# Altium schematic sheet FET_M2.SchDoc
size A
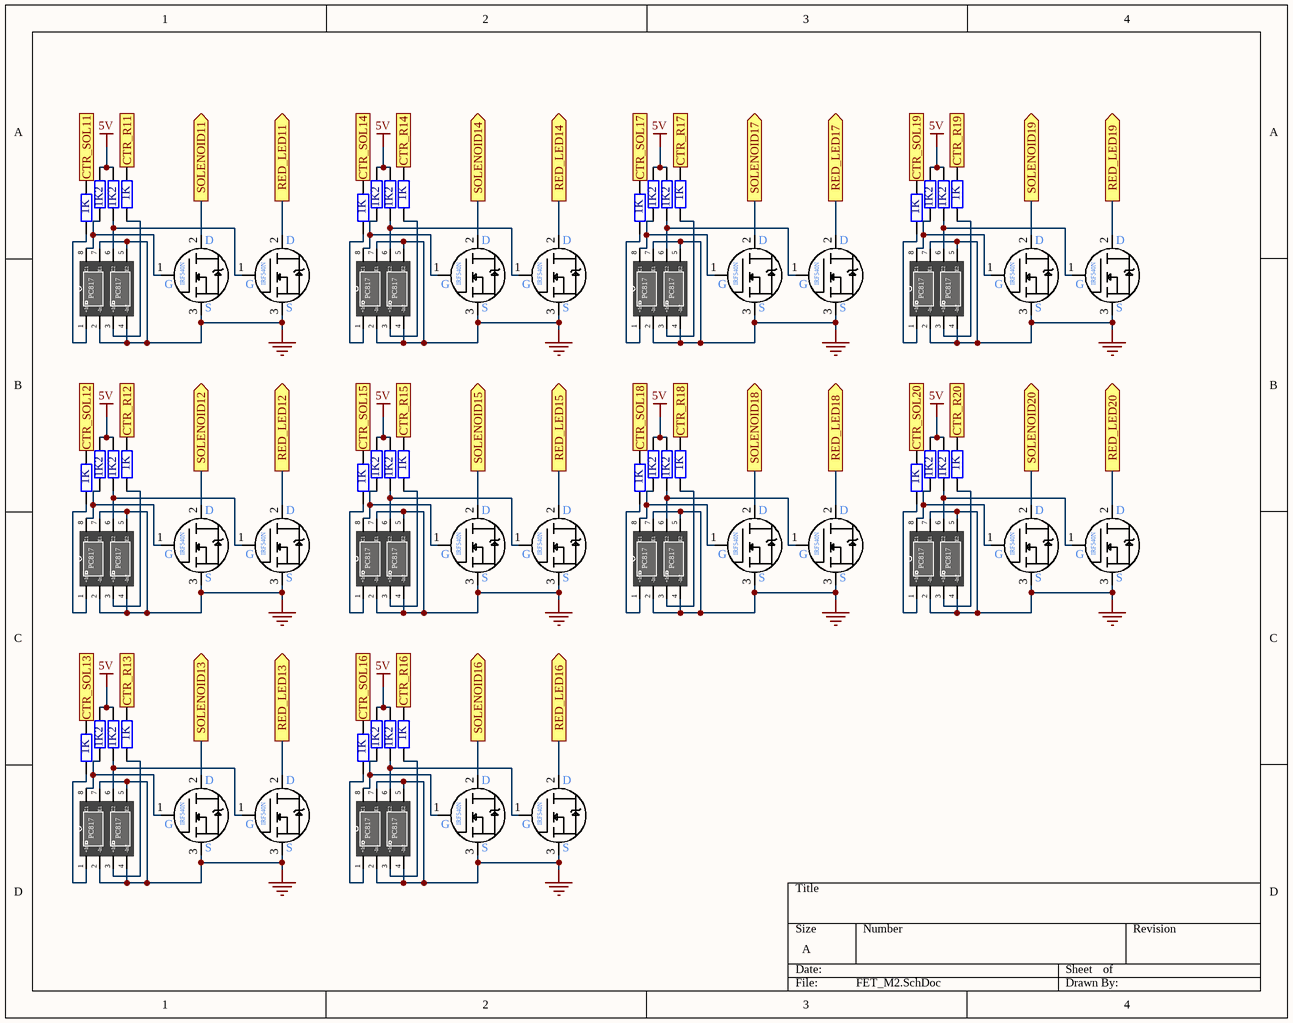
[diagram p0: FET_M2.SchDoc]

## Parts
FET21  5#IRF540N  [5#IRF540N]  (value not drawn)
FET22  5#IRF540N  [5#IRF540N]  (value not drawn)
FET23  5#IRF540N  [5#IRF540N]  (value not drawn)
FET24  5#IRF540N  [5#IRF540N]  (value not drawn)
FET25  5#IRF540N  [5#IRF540N]  (value not drawn)
FET26  5#IRF540N  [5#IRF540N]  (value not drawn)
FET27  5#IRF540N  [5#IRF540N]  (value not drawn)
FET28  5#IRF540N  [5#IRF540N]  (value not drawn)
FET29  5#IRF540N  [5#IRF540N]  (value not drawn)
FET30  5#IRF540N  [5#IRF540N]  (value not drawn)
FET31  5#IRF540N  [5#IRF540N]  (value not drawn)
FET32  5#IRF540N  [5#IRF540N]  (value not drawn)
FET33  5#IRF540N  [5#IRF540N]  (value not drawn)
FET34  5#IRF540N  [5#IRF540N]  (value not drawn)
FET35  5#IRF540N  [5#IRF540N]  (value not drawn)
FET36  5#IRF540N  [5#IRF540N]  (value not drawn)
FET37  5#IRF540N  [5#IRF540N]  (value not drawn)
FET38  5#IRF540N  [5#IRF540N]  (value not drawn)
FET39  5#IRF540N  [5#IRF540N]  (value not drawn)
FET40  5#IRF540N  [5#IRF540N]  (value not drawn)
PC11  5#Dip8_PC817x2  [5#Dip8_PC817x2]  (value not drawn)
PC12  5#Dip8_PC817x2  [5#Dip8_PC817x2]  (value not drawn)
PC13  5#Dip8_PC817x2  [5#Dip8_PC817x2]  (value not drawn)
PC14  5#Dip8_PC817x2  [5#Dip8_PC817x2]  (value not drawn)
PC15  5#Dip8_PC817x2  [5#Dip8_PC817x2]  (value not drawn)
PC16  5#Dip8_PC817x2  [5#Dip8_PC817x2]  (value not drawn)
PC17  5#Dip8_PC817x2  [5#Dip8_PC817x2]  (value not drawn)
PC18  5#Dip8_PC817x2  [5#Dip8_PC817x2]  (value not drawn)
PC19  5#Dip8_PC817x2  [5#Dip8_PC817x2]  (value not drawn)
PC20  5#Dip8_PC817x2  [5#Dip8_PC817x2]  (value not drawn)
R66  1K2  [AXIAL-0.4]
R67  1K2  [AXIAL-0.4]
R68  1K  [AXIAL-0.4]
R69  1K2  [AXIAL-0.4]
R70  1K2  [AXIAL-0.4]
R71  1K  [AXIAL-0.4]
R72  1K2  [AXIAL-0.4]
R73  1K2  [AXIAL-0.4]
R74  1K  [AXIAL-0.4]
R75  1K2  [AXIAL-0.4]
R76  1K2  [AXIAL-0.4]
R77  1K  [AXIAL-0.4]
R78  1K  [AXIAL-0.4]
R79  1K  [AXIAL-0.4]
R80  1K  [AXIAL-0.4]
R81  1K  [AXIAL-0.4]
R82  1K2  [AXIAL-0.4]
R83  1K2  [AXIAL-0.4]
R84  1K  [AXIAL-0.4]
R85  1K2  [AXIAL-0.4]
R86  1K2  [AXIAL-0.4]
R87  1K  [AXIAL-0.4]
R88  1K2  [AXIAL-0.4]
R89  1K2  [AXIAL-0.4]
R90  1K  [AXIAL-0.4]
R91  1K2  [AXIAL-0.4]
R92  1K2  [AXIAL-0.4]
R93  1K  [AXIAL-0.4]
R94  1K  [AXIAL-0.4]
R95  1K  [AXIAL-0.4]
R96  1K  [AXIAL-0.4]
R97  1K  [AXIAL-0.4]
R98  1K2  [AXIAL-0.4]
R99  1K2  [AXIAL-0.4]
R100  1K  [AXIAL-0.4]
R101  1K2  [AXIAL-0.4]
R102  1K2  [AXIAL-0.4]
R103  1K  [AXIAL-0.4]
R104  1K  [AXIAL-0.4]
R105  1K  [AXIAL-0.4]

## Ports
CTR_R11 (in), CTR_R12 (in), CTR_R13 (in), CTR_R14 (in), CTR_R15 (in), CTR_R16 (in), CTR_R17 (in), CTR_R18 (in), CTR_R19 (in), CTR_R20 (in), CTR_SOL11 (in), CTR_SOL12 (in), CTR_SOL13 (in), CTR_SOL14 (in), CTR_SOL15 (in), CTR_SOL16 (in), CTR_SOL17 (in), CTR_SOL18 (in), CTR_SOL19 (in), CTR_SOL20 (in), RED_LED11 (out), RED_LED12 (out), RED_LED13 (out), RED_LED14 (out), RED_LED15 (out), RED_LED16 (out), RED_LED17 (out), RED_LED18 (out), RED_LED19 (out), RED_LED20 (out), SOLENOID11 (out), SOLENOID12 (out), SOLENOID13 (out), SOLENOID14 (out), SOLENOID15 (out), SOLENOID16 (out), SOLENOID17 (out), SOLENOID18 (out), SOLENOID19 (out), SOLENOID20 (out)

## Nets
5V: R66.2 R67.2 R69.2 R70.2 R72.2 R73.2 R75.2 R76.2 R82.2 R83.2 R85.2 R86.2 R88.2 R89.2 R91.2 R92.2 R98.2 R99.2 R101.2 R102.2
GND: FET21.3(S) FET22.3(S) FET23.3(S) FET24.3(S) FET25.3(S) FET26.3(S) FET27.3(S) FET28.3(S) FET29.3(S) FET30.3(S) FET31.3(S) FET32.3(S) FET33.3(S) FET34.3(S) FET35.3(S) FET36.3(S) FET37.3(S) FET38.3(S) FET39.3(S) FET40.3(S) PC11.2(-In1) PC11.4(-In2) PC11.5(E2) PC11.7(E1) PC12.2(-In1) PC12.4(-In2) PC12.5(E2) PC12.7(E1) PC13.2(-In1) PC13.4(-In2) PC13.5(E2) PC13.7(E1) PC14.2(-In1) PC14.4(-In2) PC14.5(E2) PC14.7(E1) PC15.2(-In1) PC15.4(-In2) PC15.5(E2) PC15.7(E1) PC16.2(-In1) PC16.4(-In2) PC16.5(E2) PC16.7(E1) PC17.2(-In1) PC17.4(-In2) PC17.5(E2) PC17.7(E1) PC18.2(-In1) PC18.4(-In2) PC18.5(E2) PC18.7(E1) PC19.2(-In1) PC19.4(-In2) PC19.5(E2) PC19.7(E1) PC20.2(-In1) PC20.4(-In2) PC20.5(E2) PC20.7(E1)
CTR_R11: R68.1 ; port CTR_R11
CTR_R12: R84.1 ; port CTR_R12
CTR_R13: R100.1 ; port CTR_R13
CTR_R14: R71.1 ; port CTR_R14
CTR_R15: R87.1 ; port CTR_R15
CTR_R16: R103.1 ; port CTR_R16
CTR_R17: R74.1 ; port CTR_R17
CTR_R18: R90.1 ; port CTR_R18
CTR_R19: R77.1 ; port CTR_R19
CTR_R20: R93.1 ; port CTR_R20
CTR_SOL11: R78.1 ; port CTR_SOL11
CTR_SOL12: R94.1 ; port CTR_SOL12
CTR_SOL13: R104.1 ; port CTR_SOL13
CTR_SOL14: R79.1 ; port CTR_SOL14
CTR_SOL15: R95.1 ; port CTR_SOL15
CTR_SOL16: R105.1 ; port CTR_SOL16
CTR_SOL17: R80.1 ; port CTR_SOL17
CTR_SOL18: R96.1 ; port CTR_SOL18
CTR_SOL19: R81.1 ; port CTR_SOL19
CTR_SOL20: R97.1 ; port CTR_SOL20
RED_LED11: FET22.2(D) ; port RED_LED11
RED_LED12: FET30.2(D) ; port RED_LED12
RED_LED13: FET38.2(D) ; port RED_LED13
RED_LED14: FET24.2(D) ; port RED_LED14
RED_LED15: FET32.2(D) ; port RED_LED15
RED_LED16: FET40.2(D) ; port RED_LED16
RED_LED17: FET26.2(D) ; port RED_LED17
RED_LED18: FET34.2(D) ; port RED_LED18
RED_LED19: FET28.2(D) ; port RED_LED19
RED_LED20: FET36.2(D) ; port RED_LED20
SOLENOID11: FET21.2(D) ; port SOLENOID11
SOLENOID12: FET29.2(D) ; port SOLENOID12
SOLENOID13: FET37.2(D) ; port SOLENOID13
SOLENOID14: FET23.2(D) ; port SOLENOID14
SOLENOID15: FET31.2(D) ; port SOLENOID15
SOLENOID16: FET39.2(D) ; port SOLENOID16
SOLENOID17: FET25.2(D) ; port SOLENOID17
SOLENOID18: FET33.2(D) ; port SOLENOID18
SOLENOID19: FET27.2(D) ; port SOLENOID19
SOLENOID20: FET35.2(D) ; port SOLENOID20
NetFET21_1: FET21.1(G) PC11.8(C1) R66.1
NetFET22_1: FET22.1(G) PC11.6(C2) R67.1
NetFET23_1: FET23.1(G) PC12.8(C1) R69.1
NetFET24_1: FET24.1(G) PC12.6(C2) R70.1
NetFET25_1: FET25.1(G) PC13.8(C1) R72.1
NetFET26_1: FET26.1(G) PC13.6(C2) R73.1
NetFET27_1: FET27.1(G) PC14.8(C1) R75.1
NetFET28_1: FET28.1(G) PC14.6(C2) R76.1
NetFET29_1: FET29.1(G) PC15.8(C1) R82.1
NetFET30_1: FET30.1(G) PC15.6(C2) R83.1
NetFET31_1: FET31.1(G) PC16.8(C1) R85.1
NetFET32_1: FET32.1(G) PC16.6(C2) R86.1
NetFET33_1: FET33.1(G) PC17.8(C1) R88.1
NetFET34_1: FET34.1(G) PC17.6(C2) R89.1
NetFET35_1: FET35.1(G) PC18.8(C1) R91.1
NetFET36_1: FET36.1(G) PC18.6(C2) R92.1
NetFET37_1: FET37.1(G) PC19.8(C1) R98.1
NetFET38_1: FET38.1(G) PC19.6(C2) R99.1
NetFET39_1: FET39.1(G) PC20.8(C1) R101.1
NetFET40_1: FET40.1(G) PC20.6(C2) R102.1
NetPC11_1: PC11.1(+In1) R78.2
NetPC11_3: PC11.3(+In2) R68.2
NetPC12_1: PC12.1(+In1) R79.2
NetPC12_3: PC12.3(+In2) R71.2
NetPC13_1: PC13.1(+In1) R80.2
NetPC13_3: PC13.3(+In2) R74.2
NetPC14_1: PC14.1(+In1) R81.2
NetPC14_3: PC14.3(+In2) R77.2
NetPC15_1: PC15.1(+In1) R94.2
NetPC15_3: PC15.3(+In2) R84.2
NetPC16_1: PC16.1(+In1) R95.2
NetPC16_3: PC16.3(+In2) R87.2
NetPC17_1: PC17.1(+In1) R96.2
NetPC17_3: PC17.3(+In2) R90.2
NetPC18_1: PC18.1(+In1) R97.2
NetPC18_3: PC18.3(+In2) R93.2
NetPC19_1: PC19.1(+In1) R104.2
NetPC19_3: PC19.3(+In2) R100.2
NetPC20_1: PC20.1(+In1) R105.2
NetPC20_3: PC20.3(+In2) R103.2

## Notes on the sheet
- (in symbol 5#Dip8_PC817x2) PC817
- (in symbol 5#IRF540N) IRF540N

## Library data of the parts
R66-R105 = Res2: Resistor; Published: 8-Jun-2000; LatestRevisionDate: 17-Jul-2002; LatestRevisionNote: Re-released for DXP Platform.; PackageReference: AXIAL-0.4; Publisher: Altium Limited; PackageDescription: Axial Device, Thru-Hole; 2 Leads; 0.4 in Pin Spacing